# EAGLE design signal-board_v1_3 (EAGLE 7.6.0)
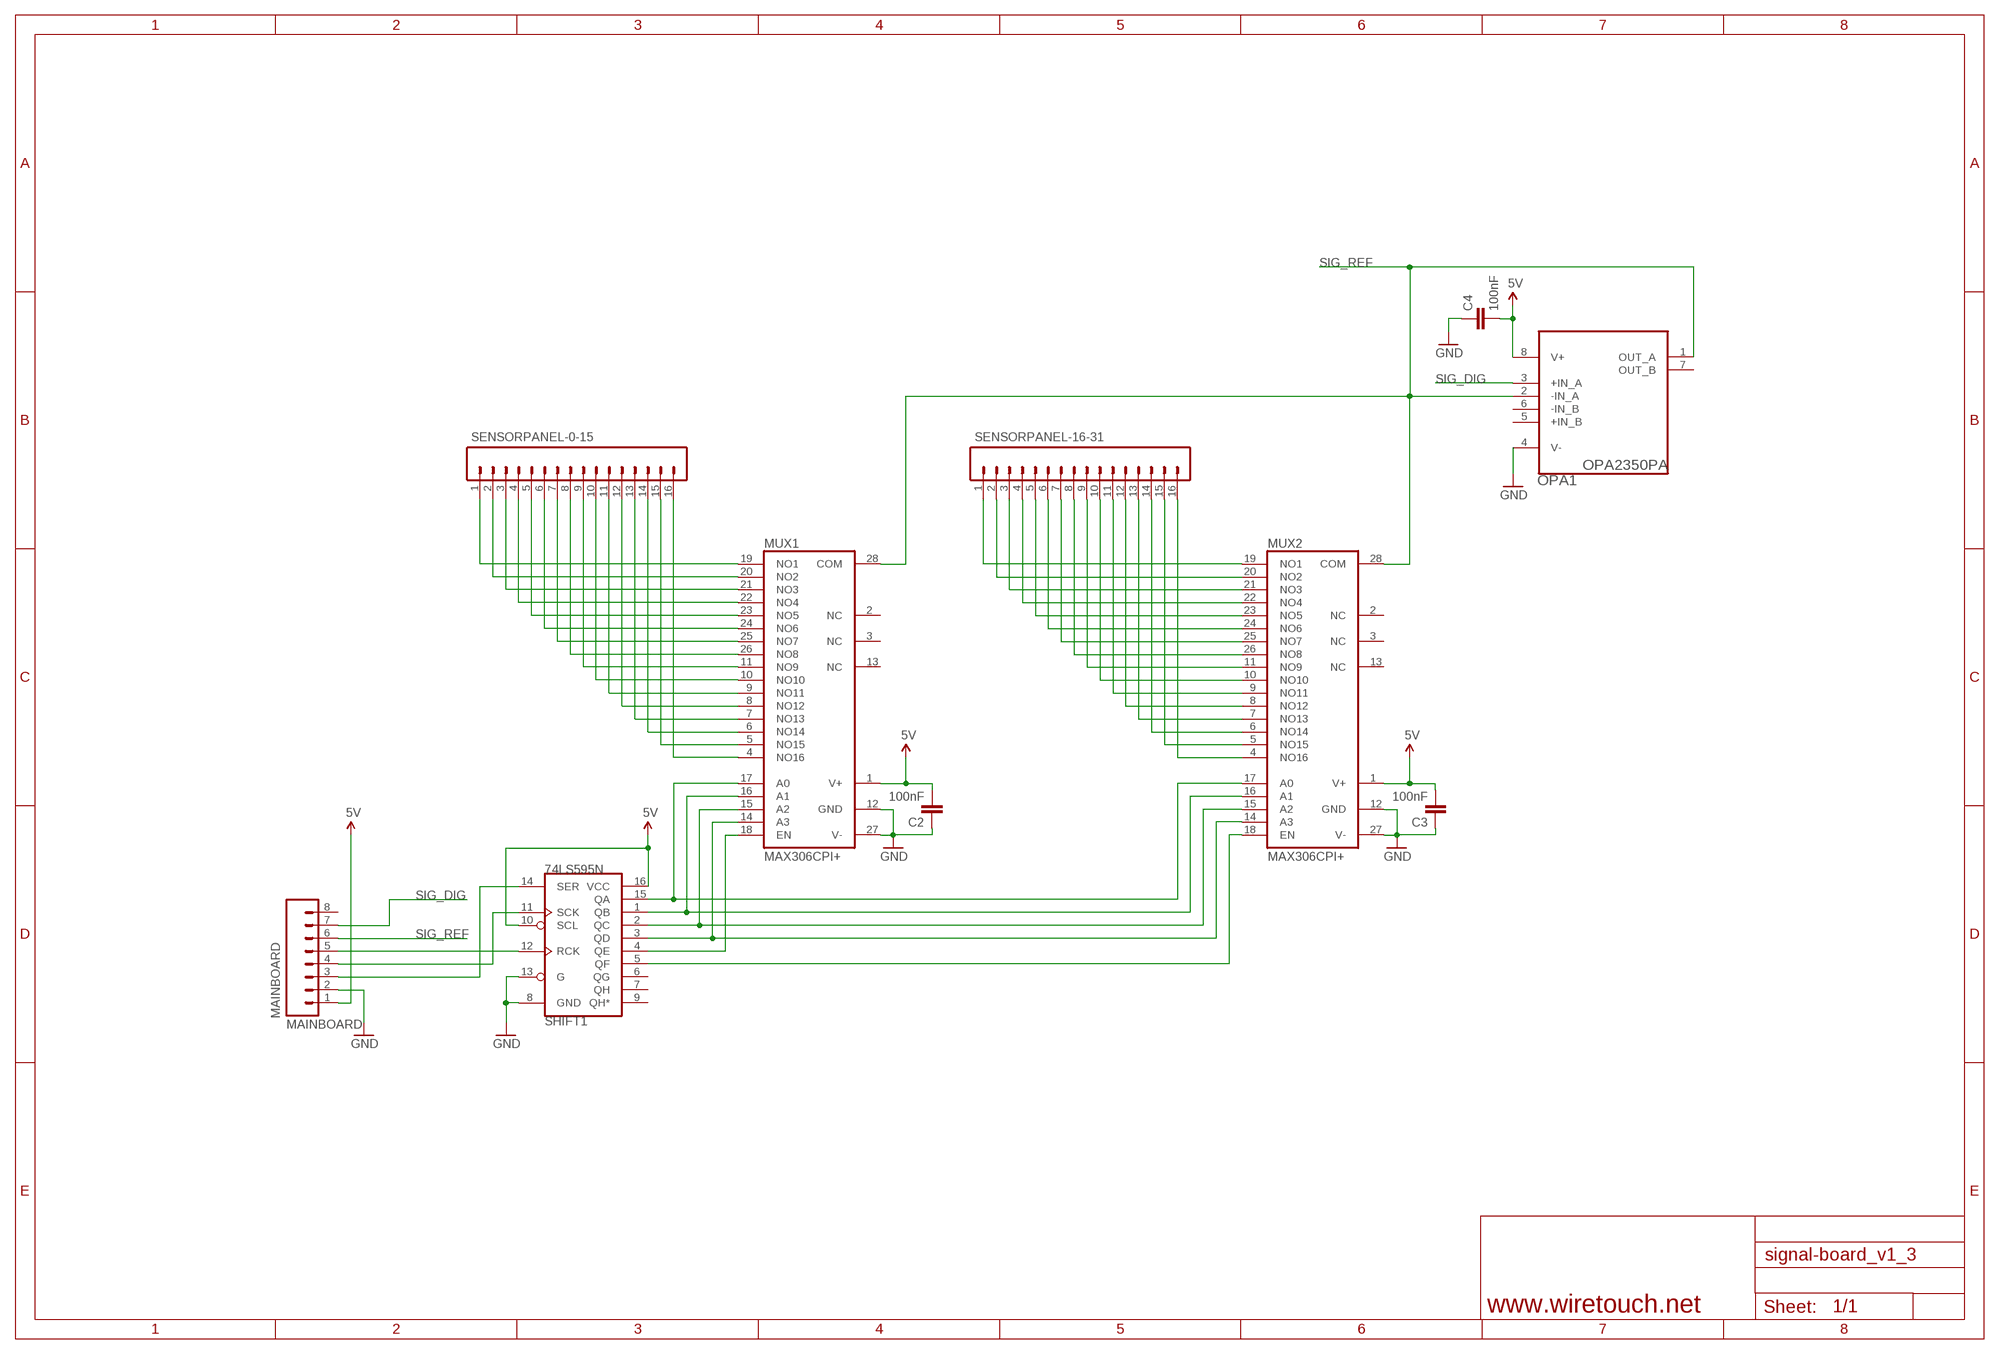
[diagram p0: schematic, sheet 1]

## Parts
C2  100nF  CAPPTH  [CAP-PTH-SMALL]
C3  100nF  CAPPTH  [CAP-PTH-SMALL]
C4  100nF  CAPPTH  [CAP-PTH-SMALL]
MAINBOARD  MAINBOARD  M08LONGPADS  [1X08_LONGPADS]
MUX1  MAX306CPI+  MAX306CPI  [DIL28-6]
MUX2  MAX306CPI+  MAX306CPI  [DIL28-6]
OPA1  OPA2350PA  [DIP254P762X508-8]
SENSORPANEL-0-15  M16LOCK_LONGPADS  [1X16_LOCK_LONGPADS]
SENSORPANEL-16-31  M16LOCK_LONGPADS  [1X16_LOCK_LONGPADS]
SHIFT1  74LS595N  [DIL16]

## Nets
5V: C2.2 C3.2 C4.2 MAINBOARD.1 MUX1.1(V+) MUX2.1(V+) OPA1.8(V+) SHIFT1.10(SCL) SHIFT1.16(VCC)
GND: C2.1 C3.1 C4.1 MAINBOARD.2 MUX1.12(GND) MUX1.27(V-) MUX2.12(GND) MUX2.27(V-) OPA1.4(V-) SHIFT1.8(GND) SHIFT1.13(G)
N$1: MUX1.19(NO1) SENSORPANEL-0-15.1
N$2: MUX1.21(NO3) SENSORPANEL-0-15.3
N$3: MUX1.23(NO5) SENSORPANEL-0-15.5
N$4: MUX1.25(NO7) SENSORPANEL-0-15.7
N$5: MUX1.11(NO9) SENSORPANEL-0-15.9
N$6: MUX1.9(NO11) SENSORPANEL-0-15.11
N$7: MUX1.7(NO13) SENSORPANEL-0-15.13
N$8: MUX1.5(NO15) SENSORPANEL-0-15.15
N$9: MUX2.19(NO1) SENSORPANEL-16-31.1
N$10: MUX2.21(NO3) SENSORPANEL-16-31.3
N$11: MUX2.23(NO5) SENSORPANEL-16-31.5
N$12: MUX2.25(NO7) SENSORPANEL-16-31.7
N$13: MUX2.11(NO9) SENSORPANEL-16-31.9
N$14: MUX2.9(NO11) SENSORPANEL-16-31.11
N$15: MUX2.7(NO13) SENSORPANEL-16-31.13
N$16: MUX2.5(NO15) SENSORPANEL-16-31.15
N$17: MUX1.20(NO2) SENSORPANEL-0-15.2
N$18: MUX1.22(NO4) SENSORPANEL-0-15.4
N$19: MUX1.24(NO6) SENSORPANEL-0-15.6
N$20: MUX1.26(NO8) SENSORPANEL-0-15.8
N$21: MUX1.10(NO10) SENSORPANEL-0-15.10
N$22: MUX1.8(NO12) SENSORPANEL-0-15.12
N$23: MUX1.6(NO14) SENSORPANEL-0-15.14
N$24: MUX1.4(NO16) SENSORPANEL-0-15.16
N$25: MUX2.20(NO2) SENSORPANEL-16-31.2
N$33: MUX1.16(A1) MUX2.16(A1) SHIFT1.1(QB)
N$34: MUX1.17(A0) MUX2.17(A0) SHIFT1.15(QA)
N$36: MUX1.15(A2) MUX2.15(A2) SHIFT1.2(QC)
N$38: MUX2.22(NO4) SENSORPANEL-16-31.4
N$39: MAINBOARD.3 SHIFT1.14(SER)
N$40: MUX1.18(EN) SHIFT1.4(QE)
N$41: MUX2.18(EN) SHIFT1.5(QF)
N$42: MAINBOARD.4 SHIFT1.11(SCK)
N$43: MUX1.14(A3) MUX2.14(A3) SHIFT1.3(QD)
N$44: MAINBOARD.5 SHIFT1.12(RCK)
N$45: MUX2.24(NO6) SENSORPANEL-16-31.6
N$46: MUX2.26(NO8) SENSORPANEL-16-31.8
N$47: MUX2.10(NO10) SENSORPANEL-16-31.10
N$48: MUX2.8(NO12) SENSORPANEL-16-31.12
N$49: MUX2.6(NO14) SENSORPANEL-16-31.14
N$50: MUX2.4(NO16) SENSORPANEL-16-31.16
SIG_DIG: MAINBOARD.7 OPA1.3(+IN_A)
SIG_REF: MAINBOARD.6 MUX1.28(COM) MUX2.28(COM) OPA1.1(OUT_A) OPA1.2(-IN_A)
Unconnected: MAINBOARD.8 MUX1.2(NC) MUX1.3(NC) MUX1.13(NC) MUX2.2(NC) MUX2.3(NC) MUX2.13(NC) OPA1.5(+IN_B) OPA1.6(-IN_B) OPA1.7(OUT_B) SHIFT1.6(QG) SHIFT1.7(QH) SHIFT1.9(QH*)

## Notes on the sheet
- www.wiretouch.net

## Library data of the parts
C2-C4 = SparkFun-Passives:CAP: Capacitor Standard 0603 ceramic capacitor, and 0.1" leaded capacitor.
MAINBOARD = SparkFun-Connectors:M08: Header 8 Standard 8-pin 0.1" header. Use with straight break away headers (SKU : PRT-00116), right angle break away headers (PRT-00553), swiss pins (PRT-00743), machine pins (PRT-00117), and female headers (PRT-00115).
MUX1 MUX2 = maxim:MAX306CPI: MULTIPLEXER; MPN: MAX306CPI; OC_FARNELL: unknown; OC_NEWARK: 90C2554
OPA1 = gkaindl:OPA2350PA: OPERATIONAL AMPLIFIER; MPN: OPA2350PA; OC_FARNELL: 4353316; OC_NEWARK: 75C4730; PACKAGE: PDIP; SUPPLIER: Texas Instruments
SENSORPANEL-0-15 SENSORPANEL-16-31 = SparkFun-Connectors:M16: 1x16 .1" header
SHIFT1 = SparkFun-DigitalIC:74*595: 8-bit SHIFT REGISTER, output latch

## Board
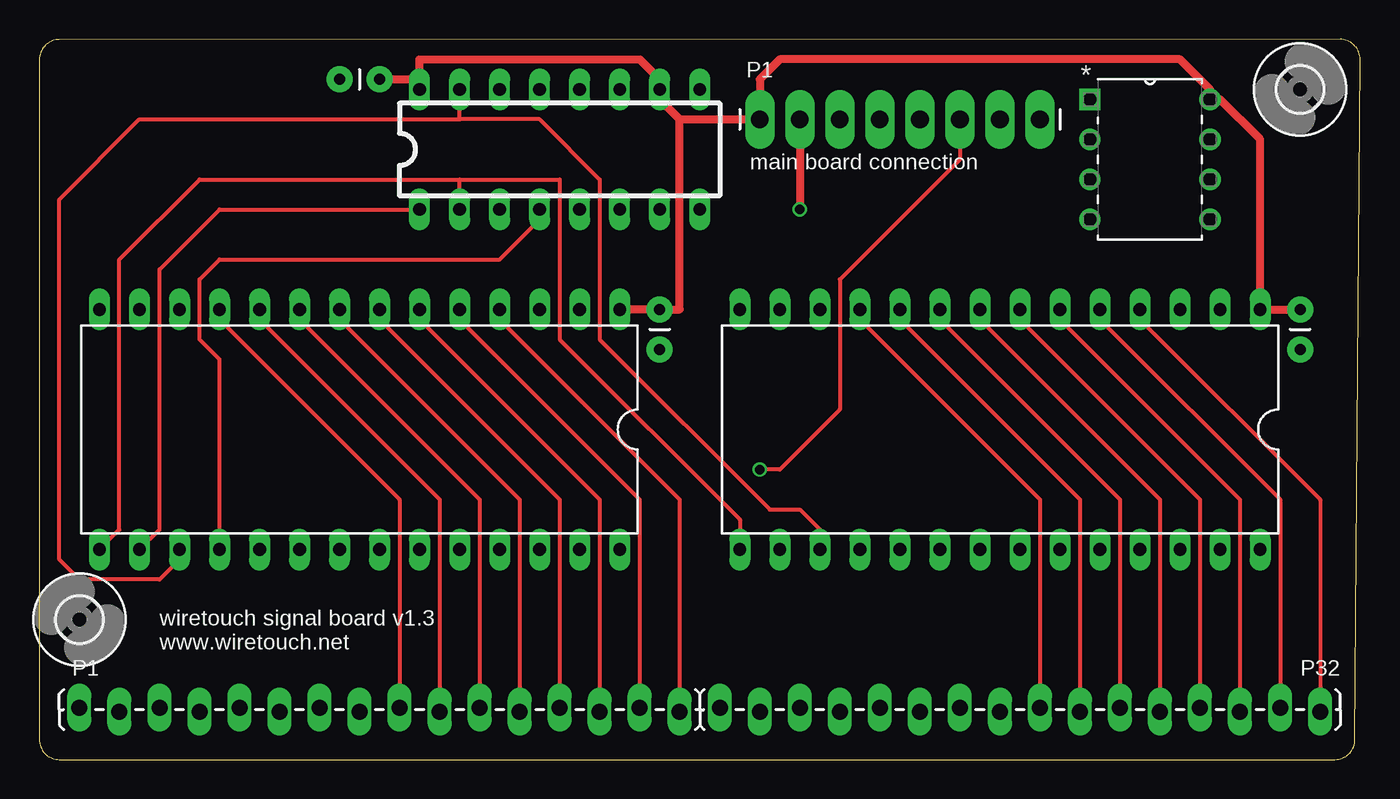
[diagram p1: board, top side]
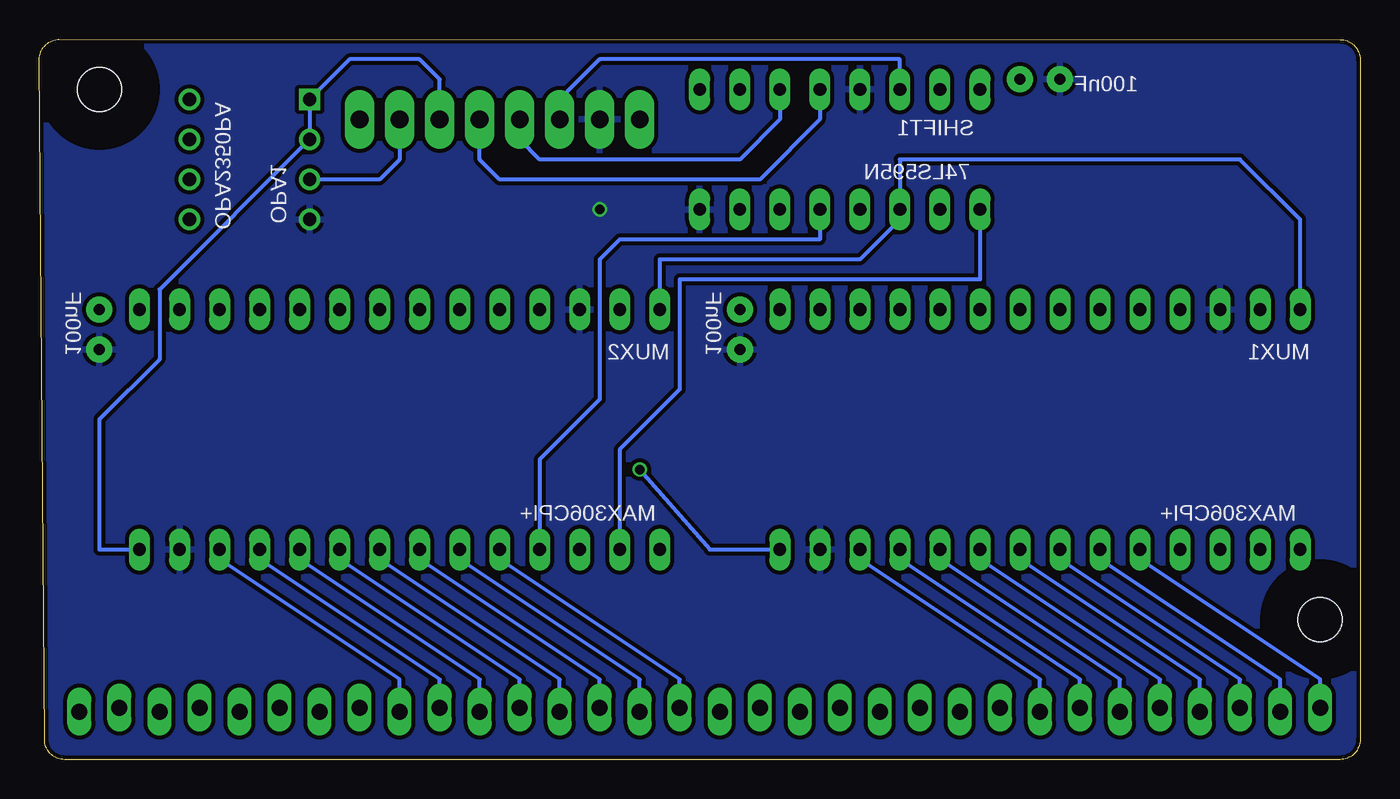
[diagram p2: board, bottom side, seen from below]

Size 83.82 x 45.72 mm. Coordinates in mm from the lower left corner, seen from the top.
Outline: 0,44.44 0,1.27 arc90 1.27,0 82.22,0 arc90 83.49,1.27 83.82,44.44 arc90 82.55,45.72 1.27,45.71 arc90 0,44.44
Copper layers (1*16): Top 0.035mm / dielectric 1.5mm / Bottom 0.035mm
Design rules "Fusion_eagle_rule_v1.1": minimum track width 6mil, minimum drill 12mil, track to track 6mil, track to pad 6mil, pad to pad 6mil, via to via 6mil, smd to smd 0mil, copper to edge 10mil, drill to drill 10mil, minimum pad ring 10mil, minimum via ring 6mil, stop-mask expansion 2mil, vias tented up to drill 100mil, thermal gap 10mil

### Footprints (pad centres in the part's own frame; a part is rotated, then mirrored left to right if it is on the bottom)
CAP-PTH-SMALL = drill 0.7 pad 1.651: 1 0,0; 2 2.54,0
1X08_LONGPADS = drill 1.118 pad 1.88 long: 1 0,0; 2 2.54,0; 3 5.08,0; 4 7.62,0; 5 10.16,0; 6 12.7,0; 7 15.24,0; 8 17.78,0
DIL28-6 = drill 0.813 long: 1 -16.51,-7.62; 2 -13.97,-7.62; 3 -11.43,-7.62; 4 -8.89,-7.62; 5 -6.35,-7.62; 6 -3.81,-7.62; 7 -1.27,-7.62; 8 1.27,-7.62; 9 3.81,-7.62; 10 6.35,-7.62; 11 8.89,-7.62; 12 11.43,-7.62; 13 13.97,-7.62; 14 16.51,-7.62; 15 16.51,7.62; 16 13.97,7.62; 17 11.43,7.62; 18 8.89,7.62; 19 6.35,7.62; 20 3.81,7.62; 21 1.27,7.62; 22 -1.27,7.62; 23 -3.81,7.62; 24 -6.35,7.62; 25 -8.89,7.62; 26 -11.43,7.62; 27 -13.97,7.62; 28 -16.51,7.62
DIP254P762X508-8 = drill 0.838 square: 1 -7.62,7.62 | drill 0.838: 2 -7.62,5.08; 3 -7.62,2.54; 4 -7.62,0; 5 0,0; 6 0,2.54; 7 0,5.08; 8 0,7.62
1X16_LOCK_LONGPADS = drill 1.016 long: 1 0,0.127; 2 2.54,-0.127; 3 5.08,0.127; 4 7.62,-0.127; 5 10.16,0.127; 6 12.7,-0.127; 7 15.24,0.127; 8 17.78,-0.127; 9 20.32,0.127; 10 22.86,-0.127; 11 25.4,0.127; 12 27.94,-0.127; 13 30.48,0.127; 14 33.02,-0.127; 15 35.56,0.127; 16 38.1,-0.127
DIL16 = drill 0.813 long: 1 -8.89,-3.81; 2 -6.35,-3.81; 3 -3.81,-3.81; 4 -1.27,-3.81; 5 1.27,-3.81; 6 3.81,-3.81; 7 6.35,-3.81; 8 8.89,-3.81; 9 8.89,3.81; 10 6.35,3.81; 11 3.81,3.81; 12 1.27,3.81; 13 -1.27,3.81; 14 -3.81,3.81; 15 -6.35,3.81; 16 -8.89,3.81
2,8 = hole 2.8: 0,0

### Placement (x,y rotation side)
C2  19.05,43.18 0 top
C3  80.01,26.04 90 top
C4  39.37,26.04 90 top
MAINBOARD  45.72,40.64 0 top
MUX1  20.32,20.95 180 top
MUX2  60.96,20.95 180 top
OPA1  74.3,34.29 0 top
SENSORPANEL-0-15  2.54,3.17 0 top
SENSORPANEL-16-31  43.18,3.17 0 top
SHIFT1  33.02,38.73 0 top
U$6  [2,8]  80.01,42.55 0 top
U$7  [2,8]  2.54,8.89 90 top

### Tracks (layer width: path | path; a pad name or v marks a point on that pad's centre or on a via)
5V
  Top 0.254: SHIFT1.10 39.37,41.91
  Top 0.508: C3.2 MUX2.1 77.47,39.37 74.93,41.91 OPA1.8 74.3,42.55 72.39,44.45 46.99,44.45 45.72,43.18 MAINBOARD.1 40.64,40.64 | MUX1.1 C4.2 40.64,28.57 40.64,40.64 | C2.2 24.13,43.18 | SHIFT1.10 39.37,43.18 38.1,44.45 24.13,44.45 24.13,43.18 | SHIFT1.16 24.13,43.18 | 39.37,41.91 40.64,40.64
GND  (via drill 0.6)
  Top 0.508: MAINBOARD.2 v48.26,34.92
  pour Bottom (isolate 0.254): 0,45.72 83.5,45.72 83.5,0 0,0
N$1
  Bottom 0.254: SENSORPANEL-0-15.1 2.54,5.08 13.97,12.7 MUX1.19
N$2
  Bottom 0.254: SENSORPANEL-0-15.3 7.62,5.08 19.05,12.7 MUX1.21
N$3
  Bottom 0.254: SENSORPANEL-0-15.5 12.7,5.08 24.13,12.7 MUX1.23
N$4
  Bottom 0.254: SENSORPANEL-0-15.7 17.78,5.08 29.21,12.7 MUX1.25
N$5
  Top 0.254: MUX1.11 11.43,27.94 22.86,16.51 SENSORPANEL-0-15.9
N$6
  Top 0.254: MUX1.9 16.51,27.94 27.94,16.51 SENSORPANEL-0-15.11
N$7
  Top 0.254: MUX1.7 21.59,27.94 33.02,16.51 SENSORPANEL-0-15.13
N$8
  Top 0.254: MUX1.5 26.67,27.94 38.1,16.51 SENSORPANEL-0-15.15
N$9
  Bottom 0.254: SENSORPANEL-16-31.1 43.18,5.08 54.61,12.7 MUX2.19
N$10
  Bottom 0.254: SENSORPANEL-16-31.3 48.26,5.08 59.69,12.7 MUX2.21
N$11
  Bottom 0.254: SENSORPANEL-16-31.5 53.34,5.08 64.77,12.7 MUX2.23
N$12
  Bottom 0.254: SENSORPANEL-16-31.7 58.42,5.08 69.85,12.7 MUX2.25
N$13
  Top 0.254: MUX2.11 52.07,27.94 63.5,16.51 SENSORPANEL-16-31.9
N$14
  Top 0.254: MUX2.9 57.15,27.94 68.58,16.51 SENSORPANEL-16-31.11
N$15
  Top 0.254: MUX2.7 62.23,27.94 73.66,16.51 SENSORPANEL-16-31.13
N$16
  Top 0.254: MUX2.5 67.31,27.94 78.74,16.51 SENSORPANEL-16-31.15
N$17
  Bottom 0.254: SENSORPANEL-0-15.2 5.08,5.08 16.51,12.7 MUX1.20
N$18
  Bottom 0.254: SENSORPANEL-0-15.4 10.16,5.08 21.59,12.7 MUX1.22
N$19
  Bottom 0.254: SENSORPANEL-0-15.6 15.24,5.08 26.67,12.7 MUX1.24
N$20
  Bottom 0.254: SENSORPANEL-0-15.8 20.32,5.08 31.75,12.7 MUX1.26
N$21
  Top 0.254: MUX1.10 13.97,27.94 25.4,16.51 SENSORPANEL-0-15.10
N$22
  Top 0.254: MUX1.8 19.05,27.94 30.48,16.51 SENSORPANEL-0-15.12
N$23
  Top 0.254: MUX1.6 24.13,27.94 35.56,16.51 SENSORPANEL-0-15.14
N$24
  Top 0.254: MUX1.4 29.21,27.94 40.64,16.51 SENSORPANEL-0-15.16
N$25
  Bottom 0.254: SENSORPANEL-16-31.2 45.72,5.08 57.15,12.7 MUX2.20
N$33
  Top 0.254: MUX1.16 7.62,14.61 7.62,31.11 11.43,34.92 SHIFT1.1
  Bottom 0.254: SHIFT1.1 24.13,30.48 43.18,30.48 43.18,23.5 46.99,19.68 MUX2.16
N$34
  Top 0.254: MUX1.17 8.89,12.7 7.62,11.43 2.54,11.43 1.27,12.7 1.27,35.56 6.35,40.64 26.67,40.64 | MUX2.17 49.53,14.61 48.26,15.88 46.35,15.88 35.56,26.67 35.56,36.83 31.75,40.64 26.67,40.64 | 26.67,40.64 SHIFT1.15
N$36
  Top 0.254: MUX1.15 5.08,14.61 5.08,31.75 10.16,36.83 26.67,36.83 | SHIFT1.2 26.67,36.83 | 26.67,36.83 33.02,36.83 33.02,26.67 44.45,15.24 MUX2.15
N$38
  Bottom 0.254: SENSORPANEL-16-31.4 50.8,5.08 62.23,12.7 MUX2.22
N$39
  Bottom 0.254: SHIFT1.14 29.21,44.45 48.26,44.45 50.8,41.91 MAINBOARD.3
N$40
  Top 0.254: MUX1.18 11.43,25.4 10.16,26.67 10.16,30.48 11.43,31.75 29.21,31.75 31.75,34.29 SHIFT1.4
  Bottom 0.254: SHIFT1.4 31.75,34.29
N$41
  Bottom 0.254: SHIFT1.5 34.29,33.02 46.99,33.02 48.26,31.75 48.26,22.86 52.07,19.05 MUX2.18
N$42
  Bottom 0.254: SHIFT1.11 36.83,40.64 39.37,38.1 52.07,38.1 53.34,39.37 MAINBOARD.4
N$43
  Bottom 0.254: MUX1.14 3.81,34.29 7.62,38.1 29.21,38.1 SHIFT1.3 29.21,34.29 31.75,31.75 44.45,31.75 MUX2.14
N$44
  Bottom 0.254: SHIFT1.12 34.29,40.64 38.1,36.83 54.61,36.83 55.88,38.1 MAINBOARD.5
N$45
  Bottom 0.254: SENSORPANEL-16-31.6 55.88,5.08 67.31,12.7 MUX2.24
N$46
  Bottom 0.254: SENSORPANEL-16-31.8 60.96,5.08 72.39,12.7 MUX2.26
N$47
  Top 0.254: MUX2.10 54.61,27.94 66.04,16.51 SENSORPANEL-16-31.10
N$48
  Top 0.254: MUX2.8 59.69,27.94 71.12,16.51 SENSORPANEL-16-31.12
N$49
  Top 0.254: MUX2.6 64.77,27.94 76.2,16.51 SENSORPANEL-16-31.14
N$50
  Top 0.254: MUX2.4 69.85,27.94 81.28,16.51 SENSORPANEL-16-31.16
SIG_DIG
  Bottom 0.254: MAINBOARD.7 60.96,38.1 62.23,36.83 OPA1.3
SIG_REF  (via drill 0.6)
  Top 0.254: MAINBOARD.6 58.42,38.1 50.8,30.48 50.8,22.23 46.99,18.41 v45.72,18.41
  Bottom 0.254: MAINBOARD.6 58.42,43.18 59.69,44.45 64.14,44.45 OPA1.1 OPA1.2 76.2,29.84 76.2,25.4 80.01,21.59 80.01,13.34 MUX2.28 | v45.72,18.41 41.27,13.34 MUX1.28

### Text on the board
tPlace: P1 | main board connection | wiretouch signal board v1.3 / www.wiretouch.net | P1 | P32